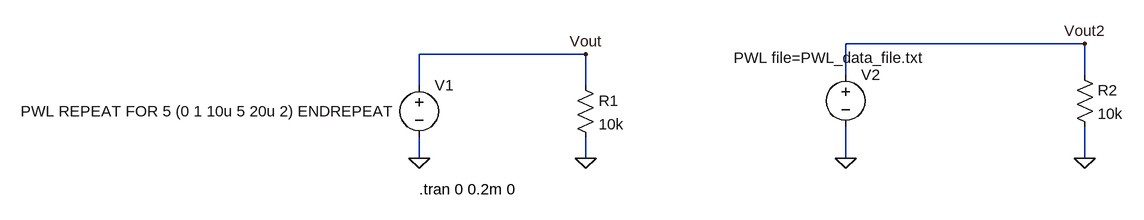
[diagram p0: schematic Piecewise_Linear_Sources.asc]
Piecewise_Linear_Sources.asc, the LTspice schematic file:
Version 4
SHEET 1 1188 680
WIRE 1120 64 752 64
WIRE 352 80 96 80
WIRE 752 112 752 64
WIRE 1120 112 1120 64
WIRE 96 128 96 80
WIRE 352 128 352 80
WIRE 96 240 96 208
WIRE 352 240 352 208
WIRE 752 240 752 192
WIRE 1120 240 1120 192
FLAG 96 240 0
FLAG 352 240 0
FLAG 352 80 Vout
FLAG 752 240 0
FLAG 1120 240 0
FLAG 1120 64 Vout2
SYMBOL voltage 96 112 R0
WINDOW 3 -613 56 Left 2
WINDOW 123 0 0 Left 0
WINDOW 39 0 0 Left 0
SYMATTR InstName V1
SYMATTR Value PWL REPEAT FOR 5 (0 1 10u 5 20u 2) ENDREPEAT
SYMBOL res 336 112 R0
SYMATTR InstName R1
SYMATTR Value 10k
SYMBOL voltage 752 96 R0
WINDOW 3 -172 -10 Left 2
WINDOW 123 0 0 Left 0
WINDOW 39 0 0 Left 0
SYMATTR InstName V2
SYMATTR Value PWL file=PWL_data_file.txt
SYMBOL res 1104 96 R0
SYMATTR InstName R2
SYMATTR Value 10k
TEXT 96 288 Left 2 !.tran 0 0.2m 0

The netlist it stands for:
* Piecewise_Linear_Sources.asc
V1 Vout 0 PWL REPEAT FOR 5 (0 1 10u 5 20u 2) ENDREPEAT
R1 Vout 0 10k
V2 Vout2 0 PWL file=PWL_data_file.txt
R2 Vout2 0 10k
.tran 0 0.2m 0
.backanno
.end

* Results of the author's LTspice run, read from the files saved beside the schematic
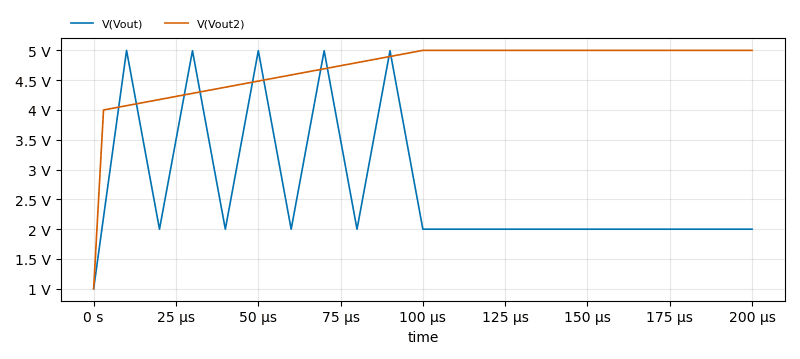
[diagram p1: Transient Analysis of Piecewise_Linear_Sources.asc, plotted from the saved traces]
* Transient Analysis, 1 run:
*   V(Vout): min 1 V, max 5 V, average 2.724 V, rms 3.013 V, last 2 V
*   V(Vout2): min 1 V, max 5 V, average 4.72 V, rms 4.742 V, last 5 V